# Altium project PCB_Project.PrjPcb
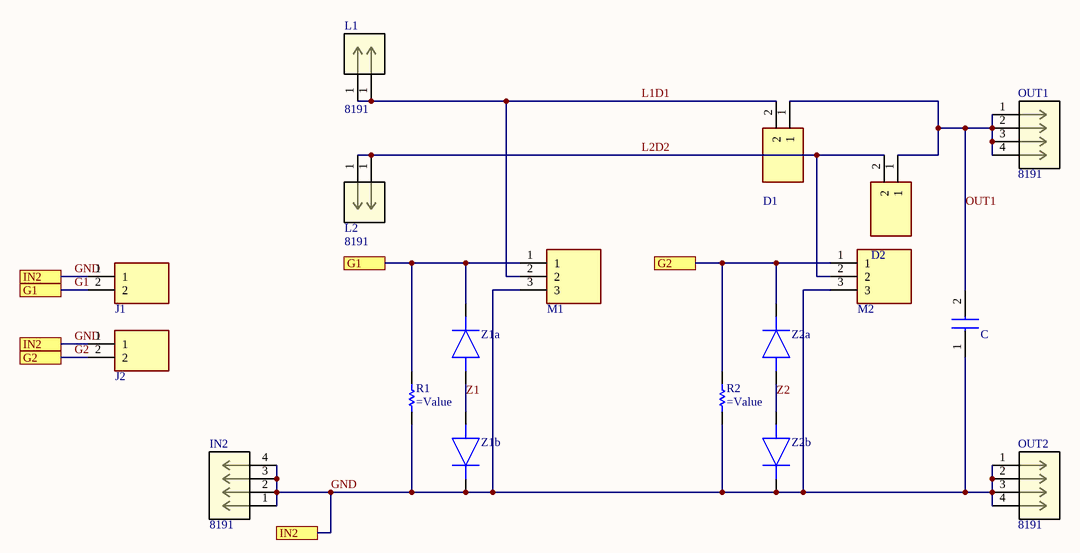
[diagram p0: Sheet1.SchDoc]
1 sheet, 18 parts. Net scope: flat (ports and power ports of the same name join across sheets).
Board file: PCB1.PcbDoc

## Sheet Sheet1.SchDoc
size 381 x 241 mm

### Parts
C  CAP  [Capacitor]  (value not drawn)
D1  TB004-508-02BE  [TERMINAL_CIN_TH_2P_5.08]  (value not drawn)
D2  TB004-508-02BE  [TERMINAL_CIN_TH_2P_5.08]  (value not drawn)
IN2  8191  [CONN_8191_KEY]
J1  TB004-508-02BE  [HEADER_MALE_TH_2P_2.54]  (value not drawn)
J2  TB004-508-02BE  [HEADER_MALE_TH_2P_2.54]  (value not drawn)
L1  8191  [TermIND]
L2  8191  [TermIND]
M1  1546551-3  [TERMINAL_TH_3P_5.08]  (value not drawn)
M2  1546551-3  [TERMINAL_TH_3P_5.08]  (value not drawn)
OUT1  8191  [CONN_8191_KEY]
OUT2  8191  [CONN_8191_KEY]
R1  Res1  [RESIS_TH_10.1]  (value not drawn)
R2  Res1  [RESIS_TH_10.1]  (value not drawn)
Z1a  TLHR5400-AS12Z  [DIODE_TH_10.1]  (value not drawn)
Z1b  TLHR5400-AS12Z  [DIODE_TH_10.1]  (value not drawn)
Z2a  TLHR5400-AS12Z  [DIODE_TH_10.1]  (value not drawn)
Z2b  TLHR5400-AS12Z  [DIODE_TH_10.1]  (value not drawn)

### Ports
G1, G2, IN2

### Nets
G1: J1.2 M1.1 R1.2 Z1a.1(K) ; port G1
G2: J2.2 M2.1 R2.2 Z2a.1(K) ; port G2
GND: C.1 IN2.1 IN2.2 IN2.3 IN2.4 J1.1 J2.1 M1.3 M2.3 OUT2.1 OUT2.2 OUT2.3 OUT2.4 R1.1 R2.1 Z1b.1(K) Z2b.1(K) ; port IN2
L1D1: D1.2 L1.1 M1.2
L2D2: D2.2 L2.1 M2.2
OUT1: C.2 D1.1 D2.1 OUT1.1 OUT1.2 OUT1.3 OUT1.4
Z1: Z1a.2(A) Z1b.2(A)
Z2: Z2a.2(A) Z2b.2(A)

### Library data of the parts
C = CAP: Capacitor; Manufacturer_Name: Kemet; Manufacturer_Part_Number: C1206X475K3RACAUTO7210; Datasheet Link: https://www.mouser.com/datasheet/2/212/1/KEM_C1078_X7R_FT_CAP_AUTO_SMD-1103315.pdf; Height: 1.95mm; Mouser Part Number: 80-C1206X475K3RAUTLR; Mouser Price/Stock: https://www.mouser.co.uk/ProductDetail/KEMET/C1206X475K3RACAUTO7210?qs=ds50AKTGxA8JAgT9kv9azQ%3D%3D
D1 D2 = Con_Terminal_2P: Connector; Manufacturer_Name: CUI Devices; Datasheet Link: https://componentsearchengine.com/Datasheets/1/TB004-508-02BE.pdf; Height: 14.1mm; Manufacturer_Part_Number: TB004-508-02BE; Arrow Part Number: TB004-508-02BE; Arrow Price/Stock: https://www.arrow.com/en/products/tb004-508-02be/cui-inc; Mouser Part Number: 490-TB004-508-02BE; Mouser Price/Stock: https://www.mouser.co.uk/ProductDetail/CUI-Devices/TB004-508-02BE?qs=vLWxofP3U2zLwdGzG2tSkA%3D%3D
IN2 OUT1 OUT2 = 8191: No Description Available; Mfr_Name: Keystone Electronics; Copyright: Copyright (C) 2022 Ultra Librarian. All rights reserved.; Manufacturer_Part_Number: 8191; RefDes: RefDes; Type: DEV
J1 J2 = Con_Header_2P: Connector; Manufacturer_Name: CUI Devices; Datasheet Link: https://componentsearchengine.com/Datasheets/1/TB004-508-02BE.pdf; Height: 14.1mm; Manufacturer_Part_Number: TB004-508-02BE; Arrow Part Number: TB004-508-02BE; Arrow Price/Stock: https://www.arrow.com/en/products/tb004-508-02be/cui-inc; Mouser Part Number: 490-TB004-508-02BE; Mouser Price/Stock: https://www.mouser.co.uk/ProductDetail/CUI-Devices/TB004-508-02BE?qs=vLWxofP3U2zLwdGzG2tSkA%3D%3D
L1 L2 = 2Pins: No Description Available; Mfr_Name: Keystone Electronics; Type: DEV; Copyright: Copyright (C) 2022 Ultra Librarian. All rights reserved.; Manufacturer_Part_Number: 8191; RefDes: RefDes
M1 M2 = Con_Terminal_3P: Terminal; Manufacturer_Name: TE Connectivity; Datasheet Link: https://www.te.com/commerce/DocumentDelivery/DDEController?Action=srchrtrv&DocNm=1546551&DocType=Customer+Drawing&DocLang=English&DocFormat=pdf&PartCntxt=1546551-3; Height: 8.5mm; Manufacturer_Part_Number: 1546551-3; Arrow Part Number: 1546551-3; Arrow Price/Stock: https://www.arrow.com/en/products/1546551-3/te-connectivity; Mouser Part Number: 571-1546551-3; Mouser Price/Stock: https://www.mouser.co.uk/ProductDetail/TE-Connectivity/1546551-3?qs=m%2FhmcwQ75LlRawcWGeRFDA%3D%3D
R1 R2 = Resistor: Published: 8-Jun-2000; LatestRevisionDate: 17-Jul-2002; LatestRevisionNote: Re-released for DXP Platform.; PackageReference: AXIAL-0.3; Publisher: Altium Limited; PackageDescription: Axial Device, Thru-Hole; 2 Leads; 0.3 in Pin Spacing; Name: =Value
Z1a Z1b Z2a Z2b = Diode: Manufacturer_Name: Vishay; Datasheet Link: http://www.vishay.com/docs/83012/tlhg540.pdf; Height: 12.8mm; Manufacturer_Part_Number: TLHR5400-AS12Z